# EAGLE design MC (EAGLE 8.3.2)
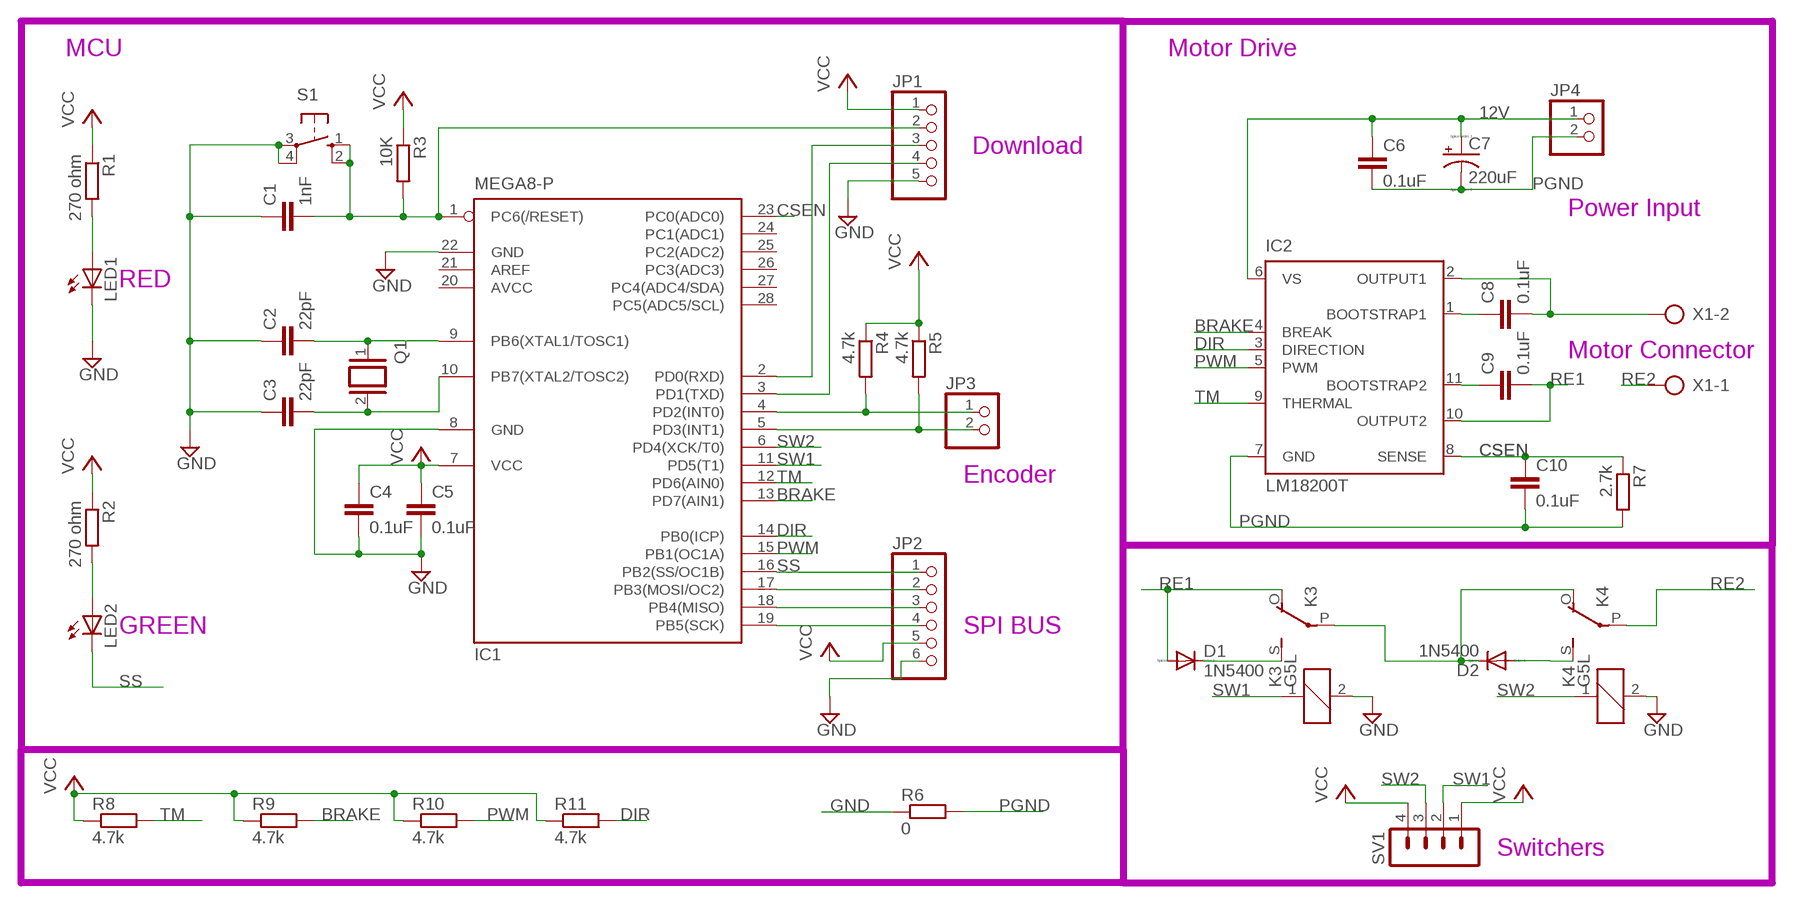
[diagram p0: schematic, sheet 1]

## Parts
C1  1nF  C-EUC0603  [C0603]
C2  22pF  C-EUC0603  [C0603]
C3  22pF  C-EUC0603  [C0603]
C4  0.1uF  C-EUC0603  [C0603]
C5  0.1uF  C-EUC0603  [C0603]
C6  0.1uF  C-EUC0603  [C0603]
C7  220uF  CPOL-USF  [PANASONIC_F]
C8  0.1uF  C-EUC0603  [C0603]
C9  0.1uF  C-EUC0603  [C0603]
C10  0.1uF  C-EUC0603  [C0603]
D1  1N5400  [DO201-15]
D2  1N5400  [DO201-15]
IC1  MEGA8-P  [DIL28-3]
IC2  LM18200T  [TO-220-11]
JP1  PINHD-1X5  [1X05]
JP2  PINHD-1X6  [1X06]
JP3  PINHD-1X2  [1X02]
JP4  PINHD-1X2  [1X02]
K3  G5L  [G5LE]
K4  G5L  [G5LE]
LED1  LEDSML0603  [SML0603]
LED2  LEDSML0603  [SML0603]
Q1  XTAL/S  [QS]
R1  270 ohm  R-EU_R0805  [R0805]
R2  270 ohm  R-EU_R0805  [R0805]
R3  10K  R-EU_R0805  [R0805]
R4  4.7k  R-EU_R0805  [R0805]
R5  4.7k  R-EU_R0805  [R0805]
R6  0  R-EU_R0603  [R0603]
R7  2.7k  R-EU_R0805  [R0805]
R8  4.7k  R-EU_R0805  [R0805]
R9  4.7k  R-EU_R0805  [R0805]
R10  4.7k  R-EU_0204/7  [0204/7]
R11  4.7k  R-EU_R0805  [R0805]
S1  10-XX  [B3F-10XX]
SV1  MA04-1  [MA04-1]
X1  AK300/2  [AK300/2]

## Nets
12V: C6.1 C7.+ IC2.6(VS) JP4.1
BRAKE: IC1.13(PD7(AIN1)) IC2.4(BREAK) R9.2
CSEN: C10.1 IC1.23(PC0(ADC0)) IC2.8(SENSE) R7.1
DIR: IC1.14(PB0(ICP)) IC2.3(DIRECTION) R11.2
GND: C1.1 C2.1 C3.1 C4.2 C5.2 IC1.8(GND) IC1.22(GND) JP1.5 JP2.6 K3.2 K4.2 LED1.C R6.1 S1.3(P) S1.4(P1)
N$1: IC1.4(PD2(INT0)) JP3.1 R4.2
N$2: C3.2 IC1.10(PB7(XTAL2/TOSC2)) Q1.2
N$4: IC1.17(PB3(MOSI/OC2)) JP2.2
N$5: IC1.18(PB4(MISO)) JP2.3
N$6: LED1.A R1.2
N$7: C8.2 IC2.2(OUTPUT1) X1.2
N$8: IC1.5(PD3(INT1)) JP3.2 R5.2
N$9: IC1.19(PB5(SCK)) JP2.4
N$10: D1.C K3.S(2:S)
N$11: IC1.2(PD0(RXD)) JP1.3
N$12: IC1.3(PD1(TXD)) JP1.4
N$13: C2.2 IC1.9(PB6(XTAL1/TOSC1)) Q1.1
N$14: C8.1 IC2.1(BOOTSTRAP1)
N$15: D2.C K3.P(2:P) K4.O(2:O)
N$16: D2.A K4.S(2:S)
N$17: C9.1 IC2.11(BOOTSTRAP2)
N$18: C1.2 IC1.1(PC6(/RESET)) JP1.2 R3.2 S1.1(S) S1.2(S1)
N$19: LED2.A R2.2
PGND: C6.2 C7.- C10.2 IC2.7(GND) JP4.2 R6.2 R7.2
PWM: IC1.15(PB1(OC1A)) IC2.5(PWM) R10.2
RE1: C9.2 D1.A IC2.10(OUTPUT2) K3.O(2:O)
RE2: K4.P(2:P) X1.1
SS: IC1.16(PB2(SS/OC1B)) JP2.1 LED2.C
SW1: IC1.11(PD5(T1)) K3.1 SV1.2
SW2: IC1.6(PD4(XCK/T0)) K4.1 SV1.3
TM: IC1.12(PD6(AIN0)) IC2.9(THERMAL) R8.2
VCC: C4.1 C5.1 IC1.7(VCC) JP1.1 JP2.5 R1.1 R2.1 R3.1 R4.1 R5.1 R8.1 R9.1 R10.1 R11.1 SV1.1 SV1.4
Unconnected: IC1.21(AREF) IC1.24(PC1(ADC1)) IC1.25(PC2(ADC2)) IC1.26(PC3(ADC3)) IC1.27(PC4(ADC4/SDA)) IC1.28(PC5(ADC5/SCL))

## Notes on the sheet
- MCU | Motor Drive
- Download
- Power Input
- RED
- Motor Connector
- Encoder
- GREEN | SPI BUS
- Switchers

## Power pins joined to a net without a drawn wire
AVCC: IC1.20(AVCC)

## Library data of the parts
C1-C6 C8-C10 = rcl:C-EU: CAPACITOR, European symbol
C7 = resistor:CPOL-US: POLARIZED CAPACITOR, American symbol
D1 D2 = diode:1N5400: DIODE standard rectifier, 3 A, 50 V (Motorola)
IC1 = atmel:MEGA8-P: MICROCONTROLLER 8 Kbytes FLASH, 1 kbytes SRAM, 512 bytes EEPROM, USART, 4-channel 10 bit ADC, 2-channel 8 bit ADC Pin compatible with Atmega48, ATMega88, ATMega168 Source: avr.lbr; OC_FARNELL: unknown; OC_NEWARK: unknown
IC2 = national-semiconductor:LM18200T: 3A, 55V H-Bridge Motor Control SourcE: http://cache.national.com/ds/LM/LMD18200.pdf; OC_FARNELL: unknown; OC_NEWARK: unknown
JP1 = pinhead:PINHD-1X5: PIN HEADER
JP2 = pinhead:PINHD-1X6: PIN HEADER
JP3 JP4 = pinhead:PINHD-1X2: PIN HEADER
K3 K4 = relay:G5L: RELAY 1 x switch, 10 A/120 V AC, 8 A/30 V ADC, Omron; OC_FARNELL: unknown; OC_NEWARK: unknown
LED1 LED2 = led:LED: LED OSRAM: - CHIPLED LG R971, LG N971, LY N971, LG Q971, LY Q971, LO R971, LY R971 LH N974, LH R974 LS Q976, LO Q976, LY Q976 LO Q996 - Hyper CHIPLED LW Q18S LB Q993, LB Q99A, LB R99A - SideLED LS A670, LO A670, LY A670, LG A670, LP A670 LB A673, LV A673, LT A673, LW A673 LH A674 LY A675 LS A676, LA A676, LO A676, LY A676, LW A676 LS A679, LY A679, LG A679 - Hyper Micro SIDELED® LS Y876, LA Y876, LO Y876, LY Y876 LT Y87S - SmartLED LW L88C, LW L88S LB L89C, LB L89S, LG L890 LS L89K, LO L89K, LY L89K LS L896, LA L896, LO L896, LY L896 - TOPLED LS T670, LO T670, LY T670, LG T670, LP T670 LSG T670, LSP T670, LSY T670, LOP T670, LYG T670 LG T671, LOG T671, LSG T671 LB T673, LV T673, LT T673, LW T673 LH T674 LS T676, LA T676, LO T676, LY T676, LB T676, LH T676, LSB T676, LW T676 LB T67C, LV T67C, LT T67C, LS T67K, LO T67K, LY T67K, LW E67C LS E67B, LA E67B, LO E67B, LY E67B, LB E67C, LV E67C, LT E67C LW T67C LS T679, LY T679, LG T679 LS T770, LO T770, LY T770, LG T770, LP T770 LB T773, LV T773, LT T773, LW T773 LH T774 LS E675, LA E675, LY E675, LS T675 LS T776, LA T776, LO T776, LY T776, LB T776 LHGB T686 LT T68C, LB T68C - Hyper Mini TOPLED® LB M676 - Mini TOPLED Santana® LG M470 LS M47K, LO M47K, LY M47K Source: http://www.osram.convergy.de LUXEON: - LUMILED® LXK2-PW12-R00, LXK2-PW12-S00, LXK2-PW14-U00, LXK2-PW14-V00 LXK2-PM12-R00, LXK2-PM12-S00, LXK2-PM14-U00 LXK2-PE12-Q00, LXK2-PE12-R00, LXK2-PE12-S00, LXK2-PE14-T00, LXK2-PE14-U00 LXK2-PB12-K00, LXK2-PB12-L00, LXK2-PB12-M00, LXK2-PB14-N00, LXK2-PB14-P00, LXK2-PB14-Q00 LXK2-PR12-L00, LXK2-PR12-M00, LXK2-PR14-Q00, LXK2-PR14-R00 LXK2-PD12-Q00, LXK2-PD12-R00, LXK2-PD12-S00 LXK2-PH12-R00, LXK2-PH12-S00 LXK2-PL12-P00, LXK2-PL12-Q00, LXK2-PL12-R00 Source: www.luxeon.com KINGBRIGHT: KA-3528ASYC Source: www.kingbright.com
Q1 = special:XTAL/S: CRYSTAL
R1-R11 = resistor:R-EU_: RESISTOR, European symbol
S1 = switch-omron:10-XX: OMRON SWITCH; MPN: B3F-1000; OC_FARNELL: 176432; OC_NEWARK: 36M3542
SV1 = con-lstb:MA04-1: PIN HEADER; OC_FARNELL: unknown; OC_NEWARK: unknown
X1 = con-ptr500:AK300/2: CONNECTOR; OC_FARNELL: unknown; OC_NEWARK: unknown

## Board
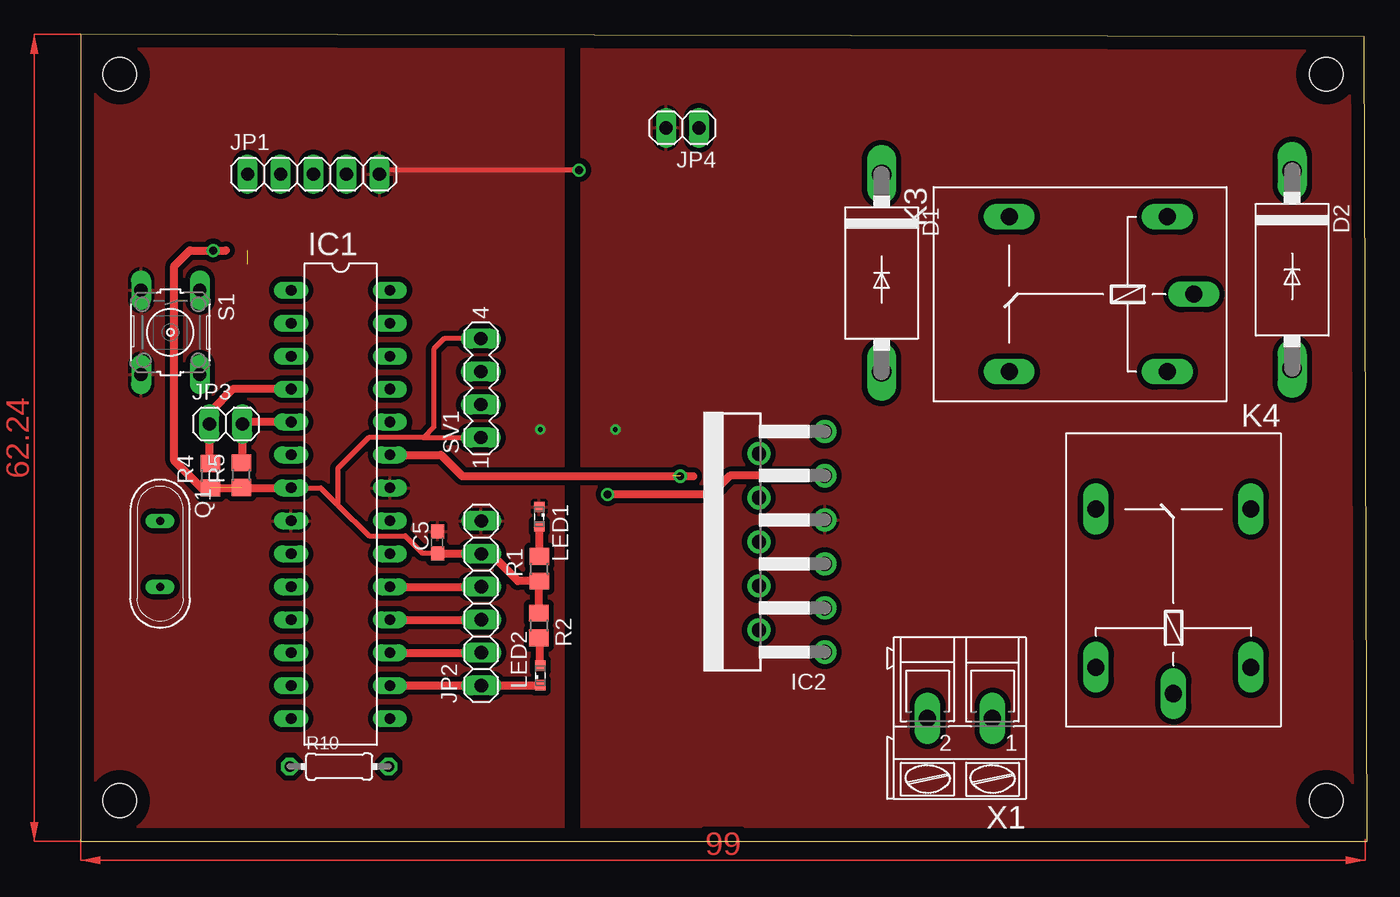
[diagram p1: board, top side]
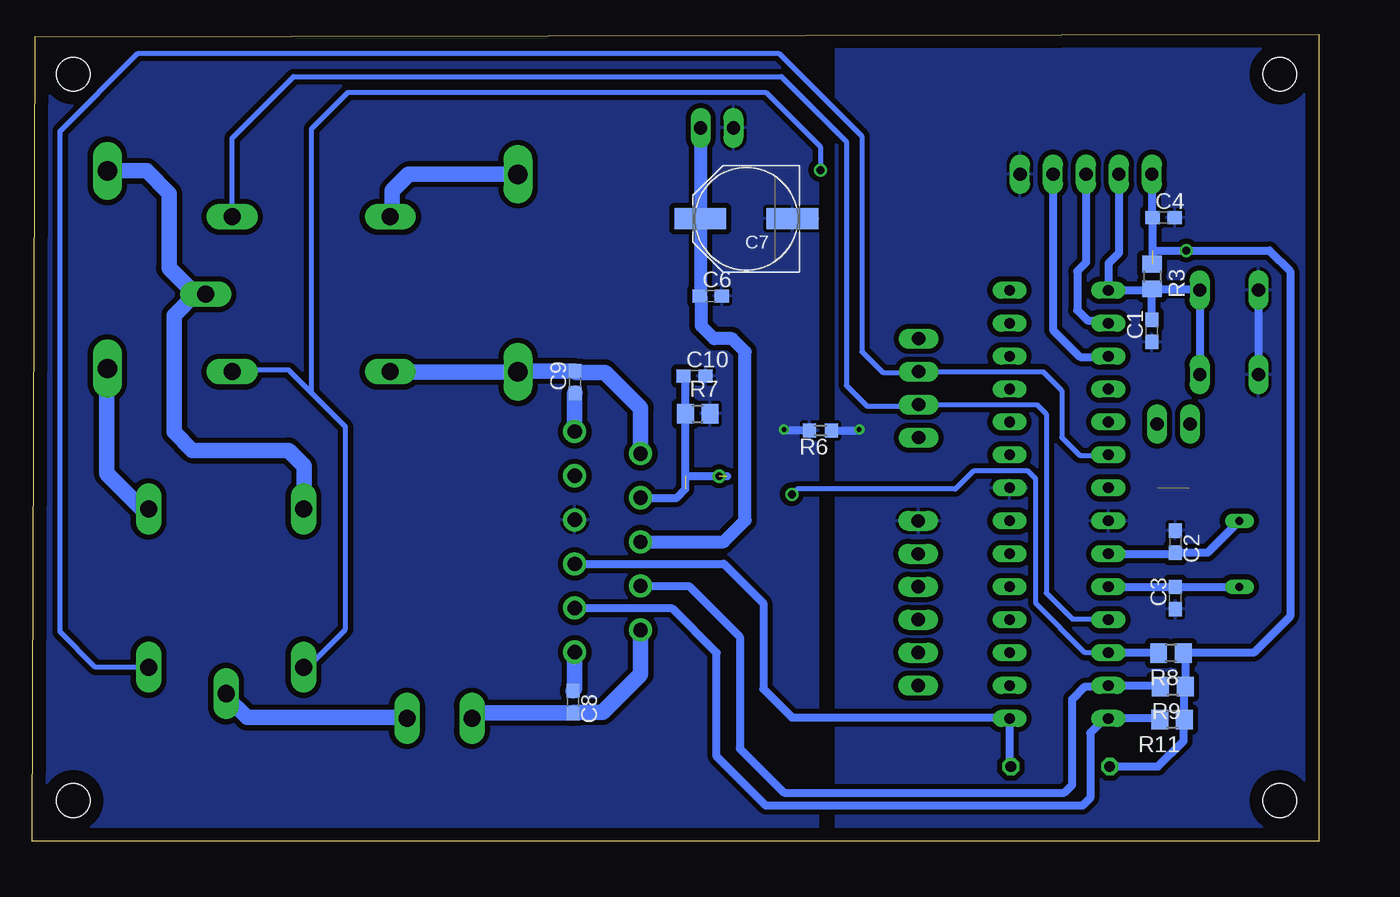
[diagram p2: board, bottom side, seen from below]

Size 99.12 x 62.24 mm. Coordinates in mm from the lower left corner, seen from the top.
Outline: 0,0 99.12,0 98.92,62.04 0,62.24 0,0
Copper layers (1*16): Top 0.035mm / dielectric 1.5mm / Bottom 0.035mm
Design rules "default *": minimum track width 6mil, minimum drill 0.35mm, track to track 0.2mm, track to pad 0.2mm, pad to pad 0.2mm, via to via 0.2mm, smd to smd 6mil, copper to edge 40mil, drill to drill 6mil, minimum pad ring 10mil, minimum via ring 8mil, stop-mask expansion 4mil, vias tented up to drill 0mil, thermal gap 10mil
Holes 2.6 mm at 2.99,59.16 95.99,59.16 2.99,3.16 95.99,3.16

### Footprints (pad centres in the part's own frame; a part is rotated, then mirrored left to right if it is on the bottom)
C0603 = smd 1.1 x 1: 1 -0.85,0; 2 0.85,0
PANASONIC_F = smd 4 x 1.6: + 3.55,0; - -3.55,0
DO201-15 = drill 1.499 long: A 7.62,0; C -7.62,0
DIL28-3 = drill 0.813 long: 1 -16.51,-3.81; 2 -13.97,-3.81; 3 -11.43,-3.81; 4 -8.89,-3.81; 5 -6.35,-3.81; 6 -3.81,-3.81; 7 -1.27,-3.81; 8 1.27,-3.81; 9 3.81,-3.81; 10 6.35,-3.81; 11 8.89,-3.81; 12 11.43,-3.81; 13 13.97,-3.81; 14 16.51,-3.81; 15 16.51,3.81; 16 13.97,3.81; 17 11.43,3.81; 18 8.89,3.81; 19 6.35,3.81; 20 3.81,3.81; 21 1.27,3.81; 22 -1.27,3.81; 23 -3.81,3.81; 24 -6.35,3.81; 25 -8.89,3.81; 26 -11.43,3.81; 27 -13.97,3.81; 28 -16.51,3.81
TO-220-11 = drill 1.1 pad 1.778: 1 -8.5,-9.37; 2 -6.8,-4.29; 3 -5.1,-9.37; 4 -3.4,-4.29; 5 -1.7,-9.37; 6 0,-4.29; 7 1.7,-9.37; 8 3.4,-4.29; 9 5.1,-9.37; 10 6.8,-4.29; 11 8.5,-9.37
1X05 = drill 1.016 long: 1 -5.08,0; 2 -2.54,0; 3 0,0; 4 2.54,0; 5 5.08,0
1X06 = drill 1.016 long: 1 -6.35,0; 2 -3.81,0; 3 -1.27,0; 4 1.27,0; 5 3.81,0; 6 6.35,0
1X02 = drill 1.016 long: 1 -1.27,0; 2 1.27,0
G5LE = drill 1.321 long: 1 -7.493,-5.969; 2 -7.493,5.969; O 4.699,5.969; P -9.525,0; S 4.699,-5.969
SML0603 = smd 0.8 x 0.8: A 0.75,0; C -0.75,0
QS = drill 0.61 long: 1 -2.54,0; 2 2.54,0
R0805 = smd 1.3 x 1.5: 1 -0.95,0; 2 0.95,0
R0603 = smd 1 x 1.1: 1 -0.85,0; 2 0.85,0
0204/7 = drill 0.813 octagon: 1 -3.81,0; 2 3.81,0
B3F-10XX = drill 1.016 long: 1 -3.251,2.261; 2 3.251,2.261; 3 -3.251,-2.261; 4 3.251,-2.261
MA04-1 = drill 1.016 long: 1 -3.81,0; 2 -1.27,0; 3 1.27,0; 4 3.81,0
AK300/2 = drill 1.321 long: 1 -2.515,0; 2 2.489,0

### Placement (x,y rotation side)
C1  12.86,39.37 90 bottom
C2  11.05,23.12 270 bottom
C3  11.05,18.77 90 bottom
C4  11.94,48.08 0 bottom
C5  27.47,23.06 90 top
C6  46.84,42.04 0 bottom
C7  44.1,48.01 180 bottom
C8  57.47,10.76 270 bottom
C9  57.31,35.41 90 bottom
C10  48.09,35.88 0 bottom
D1  61.7,43.82 270 top
D2  93.34,44.08 270 top
IC1  20.01,25.99 270 top
IC2  47.96,23.1 90 top
JP1  17.92,51.44 0 top
JP2  30.85,18.37 90 top
JP3  11.17,32.19 0 top
JP4  46.36,55.01 180 top
K3  76.24,42.19 180 top
K4  84.2,20.93 90 top
LED1  35.32,25.04 270 top
LED2  35.4,12.8 90 top
Q1  6.1,22.18 270 top
R1  35.34,21.02 90 top
R2  35.3,16.65 270 top
R3  12.82,43.55 270 bottom
R4  9.97,28.2 90 top
R5  12.37,28.25 90 top
R6  38.39,31.69 180 bottom
R7  47.85,32.98 0 bottom
R8  11.38,14.54 180 bottom
R9  11.23,11.94 180 bottom
R10  19.9,5.78 0 top
R11  11.28,9.39 180 bottom
S1  6.89,39.25 270 top
SV1  30.82,34.95 90 top
X1  67.73,9.5 180 top

### Tracks (layer width: path | path; a pad name or v marks a point on that pad's centre or on a via)
12V
  Bottom 1: IC2.6 45.85,23.1 44.19,24.76 44.19,37.76 45.19,38.76 46.59,38.76 47.59,39.76 47.59,41.94 | 47.59,41.94 C6.1 | 47.59,41.94 47.65,42 C7.+ 47.63,48.03 JP4.1
BRAKE
  Bottom 0.6: R9.2 12.26,12.02 IC1.13 16.26,11.96 17.99,11.96 18.99,10.96 18.99,4.36 19.59,3.76 41.19,3.76 44.59,7.16 44.59,15.76 48.53,19.7 IC2.4
CSEN  (via drill 0.6)  (2 unrouted)
  Top 0.6: IC1.23 27.75,29.8 29.39,28.16 v46.19,28.16 47.19,28.16
  Bottom 0.6: IC2.8 49.45,26.5 48.79,27.16 R7.1 48.8,35.74 C10.1 | 48.79,28.16 45.59,28.16
DIR
  Bottom 0.6: R11.2 12.32,9.48 IC1.14 16.47,9.48 17.59,8.36 17.59,3.36 18.19,2.76 42.59,2.76 46.39,6.56 46.39,14.56 49.79,17.96 57.29,17.96 IC2.3
GND  (via drill 0.35, 0.6)
  Top 0.4: v38.39,51.76 23.32,51.76 JP1.5
  Bottom 0.4: K4.2 77.91,13.44 74.99,16.36 74.99,31.96 77.59,34.56 | 77.59,34.56 79.39,36.36 84.19,36.36 84.39,36.16 83.79,36.16 K3.2 | 77.59,34.56 77.59,54.96 74.79,57.76 42.59,57.76 38.39,53.56 v38.39,51.76
  Bottom 0.6: S1.3 S1.4 | R6.1 35.46,31.69 v35.39,31.76
  pour Top (isolate 0.4, rank 2): -0.01,61.96 -0.01,0.16 37.19,0.16 37.19,61.96
  pour Bottom (isolate 0.4): -0.01,0.16 -0.01,61.96 37.19,61.96 37.19,0.16
N$1
  Top 0.6: IC1.4 11.71,34.88 9.99,33.16 9.99,32.28 JP3.1 9.9,29.22 R4.2
N$2
  Bottom 0.6: IC1.10 11.07,19.64 C3.2 6.12,19.62 Q1.2
N$4
  Top 0.6: IC1.17 JP2.2
N$5
  Top 0.6: IC1.18 JP2.3
N$6
  Top 0.6: R1.2 35.34,24.27 LED1.A
N$7
  Bottom 1.2: IC2.2 52.25,12.9 55.19,9.96 57.42,9.96 C8.2 64.83,9.91 X1.2
N$8
  Top 0.6: IC1.5 12.59,32.34 JP3.2 12.44,29.27 R5.2
N$9
  Top 0.6: IC1.19 JP2.4
N$10
  Bottom 1.2: D1.C 70.11,51.44 71.39,50.16 71.39,48.31 K3.S
N$11
  Bottom 0.6: JP1.3 17.92,44.63 18.59,43.96 18.59,40.96 17.79,40.16 16.4,40.16 IC1.2
N$12
  Bottom 0.6: JP1.4 20.46,39.43 18.39,37.36 16.26,37.36 IC1.3
N$13
  Bottom 0.6: IC1.9 11.14,22.18 C2.2 8.55,22.27 Q1.1
N$14
  Bottom 1.2: IC2.1 57.33,11.75 C8.1
N$15
  Bottom 1.2: 86.56,42.19 K3.P | 86.56,42.19 88.19,40.56 88.19,31.56 86.79,30.16 79.39,30.16 78.19,28.96 78.19,25.67 K4.O | D2.C 90.33,51.7 88.59,49.96 88.59,44.22 86.56,42.19
N$16
  Bottom 1.2: K4.S 90.66,25.63 93.39,28.36 93.39,36.41 D2.A
N$17
  Bottom 1.2: IC2.11 57.33,34.54 C9.1
N$18
  Bottom 0.6: IC1.1 | IC1.1 12.92,42.5 R3.2 | R3.2 9.25,42.6 S1.1 S1.2 | JP1.2 15.38,45.37 16.19,44.56 IC1.1 | C1.2 12.86,42.56 R3.2
N$19
  Top 0.6: LED2.A 35.4,15.6 R2.2
PGND  (via drill 0.35)
  Bottom 0.6: R6.2 41.12,31.69 v41.19,31.76
  pour Top (isolate 0.4, rank 2): 38.59,61.96 38.59,0.16 98.99,0.16 98.99,61.96
  pour Bottom (isolate 0.4, rank 2): 38.59,61.96 38.59,0.16 54.19,0.16 98.99,0.16 98.99,61.96
PWM
  Bottom 0.6: R10.2 23.82,5.89 IC1.15 23.9,9.56 40.59,9.56 42.79,11.76 42.79,18.36 45.83,21.4 IC2.5
RE1
  Bottom 1.2: IC2.10 52.25,33.42 54.99,36.16 57.21,36.16 C9.2 61.64,36.26 D1.A 71.52,36.2 K3.O
RE2
  Bottom 1.2: K4.P 84.2,11.17 82.59,9.56 70.3,9.56 X1.1
SS
  Top 0.6: IC1.16 JP2.1 35.37,12.02 LED2.C
SW1
  Bottom 0.4: IC1.11 16.26,17.16 18.99,17.16 20.99,19.16 20.99,32.96 21.71,33.68 30.59,33.68 | 30.59,33.68 SV1.2 | K3.1 83.73,54.22 78.99,58.96 41.39,58.96 36.39,53.96 36.39,35.16 34.79,33.56 31.59,33.56 31.39,33.36 30.91,33.36 30.59,33.68
SW2
  Bottom 0.4: IC1.6 16.24,29.76 18.39,29.76 19.79,31.16 19.79,34.76 21.25,36.22 SV1.3 30.88,36.16 33.59,36.16 35.19,37.76 35.19,54.36 41.59,60.76 90.99,60.76 96.99,54.76 96.99,16.16 94.27,13.44 K4.1
TM  (via drill 0.6)
  Top 0.6: IC2.9 50.03,28.2 48.59,26.76 v40.59,26.76
  Bottom 0.4: IC1.12 17.99,14.56 21.79,18.36 21.79,27.96 22.39,28.56 26.59,28.56 27.79,27.36 27.99,27.16 40.19,27.16 v40.59,26.76
  Bottom 0.6: IC1.12 12.35,14.56 R8.2
VCC  (via drill 0.6)  (2 unrouted)
  Top 0.4: C5.1 26.34,22.21 24.99,23.56 22.19,23.56 19.79,25.96 | IC1.7 18.49,27.26 19.79,25.96 | 26.39,31.14 SV1.1 | 26.39,31.14 22.17,31.14 19.79,28.76 19.79,25.96 | SV1.4 27.99,38.76 27.19,37.96 27.19,31.94 26.39,31.14
  Top 0.6: R2.1 35.3,20.03 R1.1 33.68,20.07 31.59,22.16 30.87,22.16 JP2.5 27.5,22.18 C5.1 | IC1.7 R4.1 9.3,27.25 7.19,29.36 7.19,44.36 8.39,45.56 v10.19,45.56 11.19,45.56
  Bottom 0.6: JP1.1 12.84,48.13 C4.1 12.79,44.53 R3.1 | 12.79,45.56 v10.19,45.56 3.79,45.56 2.19,43.96 2.19,17.36 4.99,14.56 10.11,14.56 10.28,14.39 | R10.1 12.37,5.78 10.39,7.76 10.39,9.33 R11.1 10.33,11.89 R9.1 10.28,14.39 | 10.28,14.39 R8.1
(copper drawn outside any net)
  shapes: Top area x2